# Altium project VEX Over Under.PrjPcb
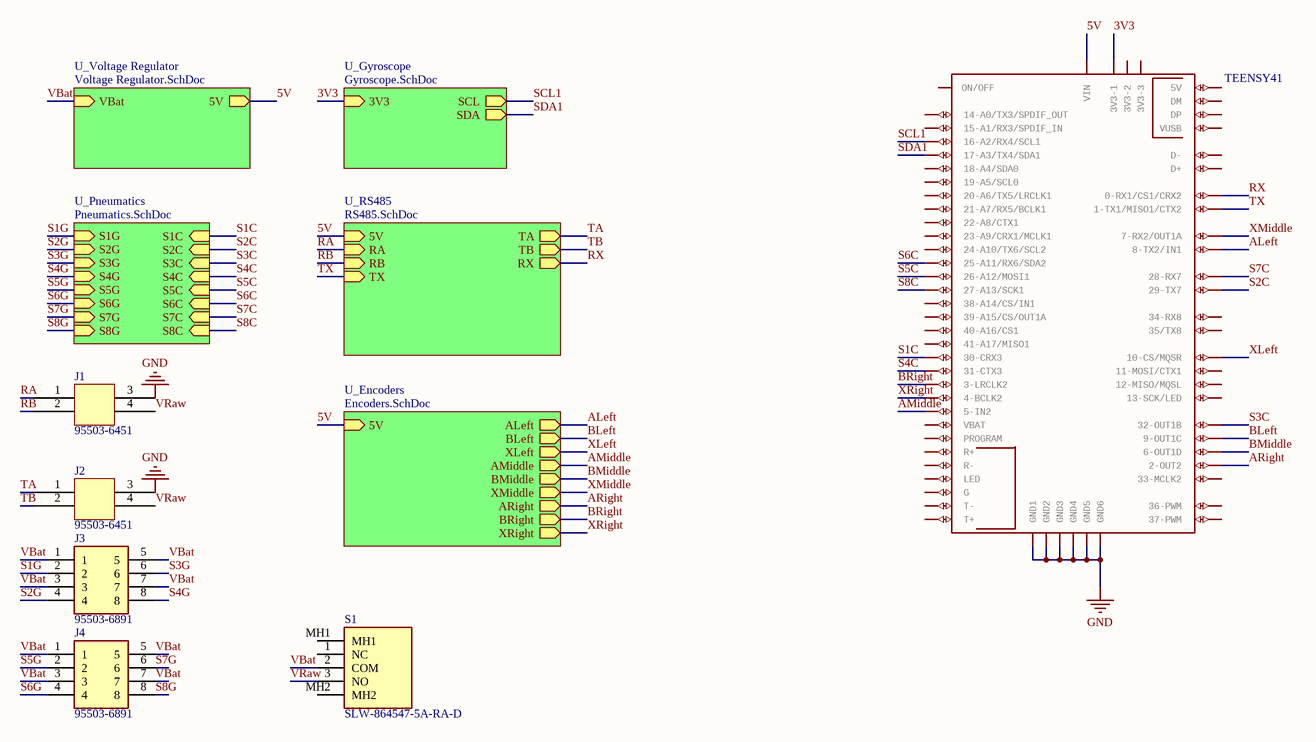
[diagram p0: Top Level.SchDoc]
6 sheets, 51 parts. Net scope: hierarchical (ports join the sheet entries above them; power ports are global).
Board file: JBrain.PcbDoc
Sheets:
  Top Level.SchDoc
    U_Voltage Regulator = Voltage Regulator.SchDoc
    U_Pneumatics = Pneumatics.SchDoc
    U_Gyroscope = Gyroscope.SchDoc
    U_RS485 = RS485.SchDoc
    U_Encoders = Encoders.SchDoc

## Sheet Top Level.SchDoc: Top Level
size A4; Engineer: Jason Zhou; Organization: JANK; DocumentNumber: 1; Revision: 1; SheetNumber: 1; SheetTotal: 6; Projectidentifier: V5 Co-processor

### Parts
J1  95503-6451  [95503-6451-Footprint-1]
J2  95503-6451  [95503-6451-Footprint-1]
J3  95503-6891  [95503-6891]
J4  95503-6891  [95503-6891]
S1  SLW-864547-5A-RA-D  [SLW8645475ARAD]
U1  TEENSY41  [TEENSY41]

### Sub-sheets
U_Encoders = Encoders.SchDoc: BLeft (out), ALeft (out), XLeft (out), BMiddle (out), AMiddle (out), XMiddle (out), BRight (out), ARight (out), XRight (out), 5V (in)
U_Gyroscope = Gyroscope.SchDoc: 3V3 (in), SCL (out), SDA (out)
U_Pneumatics = Pneumatics.SchDoc: S1G (in), S2G (in), S3G (in), S4G (in), S5G (in), S1C (in), S2C (in), S3C (in), S4C (in), S5C (in), S6G (in), S6C (in), S7C (in), S8G (in), S7G (in), S8C (in)
U_RS485 = RS485.SchDoc: TA (out), RA (in), 5V (in), RB (in), TB (out), RX (out), TX (in)
U_Voltage Regulator = Voltage Regulator.SchDoc: VBat (in), 5V (out)

### Nets
GND: J1.3 J2.3 U1.GND1 U1.GND2 U1.GND3 U1.GND4 U1.GND5 U1.GND6
3V3: U1.3V3-1 ; sheet U_Gyroscope/3V3
5V: U1.VIN ; sheet U_Voltage Regulator/5V, sheet U_RS485/5V, sheet U_Encoders/5V
ALeft: U1.8-TX2/IN1 ; sheet U_Encoders/ALeft
AMiddle: U1.5-IN2 ; sheet U_Encoders/AMiddle
ARight: U1.2-OUT2 ; sheet U_Encoders/ARight
BLeft: U1.9-OUT1C ; sheet U_Encoders/BLeft
BMiddle: U1.6-OUT1D ; sheet U_Encoders/BMiddle
BRight: U1.3-LRCLK2 ; sheet U_Encoders/BRight
RA: J1.1 ; sheet U_RS485/RA
RB: J1.2 ; sheet U_RS485/RB
RX: U1.0-RX1/CS1/CRX2 ; sheet U_RS485/RX
S1C: U1.30-CRX3 ; sheet U_Pneumatics/S1C
S1G: J3.2 ; sheet U_Pneumatics/S1G
S2C: U1.29-TX7 ; sheet U_Pneumatics/S2C
S2G: J3.4 ; sheet U_Pneumatics/S2G
S3C: U1.32-OUT1B ; sheet U_Pneumatics/S3C
S3G: J3.6 ; sheet U_Pneumatics/S3G
S4C: U1.31-CTX3 ; sheet U_Pneumatics/S4C
S4G: J3.8 ; sheet U_Pneumatics/S4G
S5C: U1.26-A12/MOSI1 ; sheet U_Pneumatics/S5C
S5G: J4.2 ; sheet U_Pneumatics/S5G
S6C: U1.25-A11/RX6/SDA2 ; sheet U_Pneumatics/S6C
S6G: J4.4 ; sheet U_Pneumatics/S6G
S7C: U1.28-RX7 ; sheet U_Pneumatics/S7C
S7G: J4.6 ; sheet U_Pneumatics/S7G
S8C: U1.27-A13/SCK1 ; sheet U_Pneumatics/S8C
S8G: J4.8 ; sheet U_Pneumatics/S8G
SCL1: U1.16-A2/RX4/SCL1 ; sheet U_Gyroscope/SCL  [project net SCL]
SDA1: U1.17-A3/TX4/SDA1 ; sheet U_Gyroscope/SDA  [project net SDA]
TA: J2.1 ; sheet U_RS485/TA
TB: J2.2 ; sheet U_RS485/TB
TX: U1.1-TX1/MISO1/CTX2 ; sheet U_RS485/TX
VBat: J3.1 J3.3 J3.5 J3.7 J4.1 J4.3 J4.5 J4.7 S1.2(COM) ; sheet U_Voltage Regulator/VBat
VRaw: J1.4 J2.4 S1.3(NO)
XLeft: U1.10-CS\MQSR(10-CS/MQSR) ; sheet U_Encoders/XLeft
XMiddle: U1.7-RX2/OUT1A ; sheet U_Encoders/XMiddle
XRight: U1.4-BCLK2 ; sheet U_Encoders/XRight

Not connected (* = marked no-connect by the designer): S1 1(NC) MH1 MH2; U1 3V3-2 3V3-3 11-MOSI/CTX1 12-MISO/MQSL 13-SCK/LED 14-A0/TX3/SPDIF_OUT 15-A1/RX3/SPDIF_IN 18-A4/SDA0 19-A5/SCL0 20-A6/TX5/LRCLK1 21-A7/RX5/BCLK1 22-A8/CTX1 23-A9/CRX1/MCLK1 24-A10/TX6/SCL2 33-MCLK2 34-RX8 35-TX8(35/TX8) 36-PWM 37-PWM 38-A14/CS/IN1 39-A15/CS/OUT1A 40-A16/CS1 41-A17/MISO1 +5V(5V) D+ D- DM DP G LED ON/OFF PROGRAM R+ R- T+ T- VBAT VUSB

### Notes on the sheet
- Size:
- Date:
- Title
- A4
- Project:
- Time:
- Revision:
- Sheet
- of
- Engineer
- File:

### Library data of the parts
J1 J2 = CMP-002-00072-2: Telecom and Datacom Connector, 4 Contact(s), Female, Straight, Surface Mount Terminal, Locking, Jack, 4p4c; RoHS Compliant: Yes; Mounting Technology: Board; Connector Type: TELECOM AND DATACOM CONNECTOR; Min Operating Temperature: -40°C; Max Operating Temperature: 85°C
J3 J4 = 95503-6891: Connector; Manufacturer_Name: Molex; Datasheet Link: https://datasheet.datasheetarchive.com/originals/distributors/Datasheets-DGA5/408567.pdf; Manufacturer_Part_Number: 95503-6891; Mouser Part Number: 538-95503-6891; Mouser Price/Stock: https://www.mouser.co.uk/ProductDetail/Molex/95503-6891?qs=MJut%252BdqOEgjIr%252BakMzdZ%252BA%3D%3D
S1 = SLW-864547-5A-RA-D: Switch; Manufacturer_Name: CUI Devices; Datasheet Link: https://www.cuidevices.com/product/resource/slw-864547-5a-ra-d.pdf; Height: 4.9mm; Manufacturer_Part_Number: SLW-864547-5A-RA-D; Mouser Part Number: 179-SLW-864547-5ARAD; Mouser Price/Stock: https://www.mouser.co.uk/ProductDetail/CUI-Devices/SLW-864547-5A-RA-D?qs=1Kr7Jg1SGW%252Bn%2FarYZIP3WQ%3D%3D; Arrow Part Number: SLW-864547-5A-RA-D; Arrow Price/Stock: https://www.arrow.com/en/products/slw-864547-5a-ra-d/cui-devices?region=nac
U1 = CMP-007-000001-4: Teensy 4.1 Development Board; Core Architecture: ARM; Evaluation Kit: Yes; GateName_1: G$1; LibraryName: teensy; Package: TEENSY41; DeviceSetName: TEENSY41; Source: teensy.SCHLIB; Series: i.MX; SymbolName_1: TEENSY41; Design Item ID: TEENSY41

## Sheet Voltage Regulator.SchDoc: Voltage Regulator
size A4; Author: Jason Zhou; Engineer: Jason Zhou; Revision: 1; SheetNumber: 2; SheetTotal: 5; Projectidentifier: V5 Coprocessor; SPICEModelCacheAZWFLMOM: <root> / <DocumentId>AZWFLMOM</DocumentId> / </root>
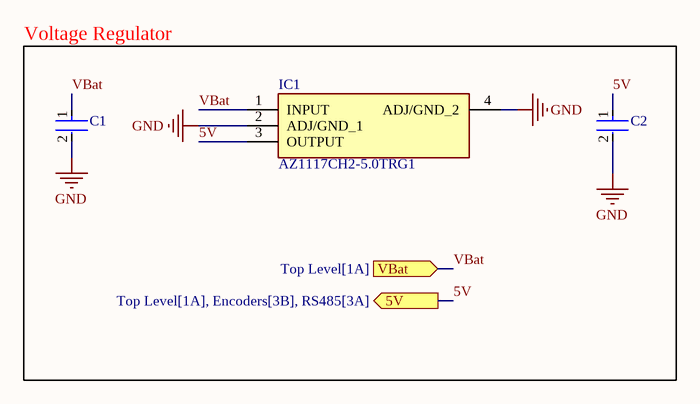
[diagram p1: Voltage Regulator.SchDoc]

### Parts
C1  CL31A106MAHNNNE  [FP-CL31-IPC_B]  (value not drawn)
C2  CL31A226MOCLNNC  [FP-CL31-IPC_A]  (value not drawn)
IC1  AZ1117CH2-5.0TRG1  [SOT230P700X180-4N]

### Blocks framed on the sheet
Voltage Regulator: C1 C2 IC1

### Ports
5V (out, see Top Level[1A], Encoders[3B], RS485[3A]), VBat (in, see Top Level[1A])

### Nets
GND: C1.2 C2.2 IC1.2(ADJ/GND_1) IC1.4(ADJ/GND_2)
5V: C2.1 IC1.3(OUTPUT) ; port 5V
VBat: C1.1 IC1.1(INPUT) ; port VBat

### Notes on the sheet
- Size:
- Date:
- Title
- A4
- Project:
- Time:
- Revision:
- Sheet
- of
- Engineer
- File:

### Library data of the parts
C1 = CMP-13271-000714-1: Cap Ceramic 10uF 25V X5R ±20% SMD 1206 +85°C Embossed T/R; Depth: 1.6mm; Length: 3.2mm; Thickness: 0.071inch; Voltage Rating: 25V; Width: 0.063inch; Mount: Surface Mount; Height: 1.6mm; Dielectric: X5R; Case Code (Metric): 3216; Case/Package: 1206; Radiation Hardening: No; Lead Free: Lead Free; Min Operating Temperature: -55°C; Tolerance: 20%; Voltage Rating (DC): 25V; Packaging: Tape and Reel; Capacitance: 10uF; Case Code (Imperial): 1206; Max Operating Temperature: 85°C
C2 = CMP-13271-002013-1: Cap Ceramic 22uF 16V X5R ±20% SMD 1206 +85°C Embossed T/R; Height: 0.85mm; Min Operating Temperature: -55°C; Thickness: 0.037inch; Depth: 1.6mm; Length: 3.2mm; Tolerance: 20%; Case Code (Imperial): 1206; Capacitance: 22uF; Package Quantity: 1; Radiation Hardening: No; Case/Package: 1206; Dielectric: X5R; Packaging: Tape and Reel; Voltage: 16V; Case Code (Metric): 3216; Width: 0.063inch; Lead Free: Lead Free; Mount: Surface Mount; Voltage Rating: 16V; Max Operating Temperature: 85°C
IC1 = AZ1117CH2-5.0TRG1: Integrated Circuit; Manufacturer_Name: Diodes Incorporated; Datasheet Link: https://www.arrow.com/en/products/az1117ch2-5.0trg1/diodes-incorporated; Height: 1.8mm; Manufacturer_Part_Number: AZ1117CH2-5.0TRG1; Mouser Part Number: 621-AZ1117CH2-5.0TRG; Mouser Price/Stock: https://www.mouser.co.uk/ProductDetail/Diodes-Incorporated/AZ1117CH2-5.0TRG1?qs=5V6w%252Be2aIqb578qtLdqPjw%3D%3D; Arrow Part Number: AZ1117CH2-5.0TRG1; Arrow Price/Stock: https://www.arrow.com/en/products/az1117ch2-5.0trg1/diodes-incorporated

## Sheet Pneumatics.SchDoc: Solenoid Drivers
size A4; Engineer: Jason Zhou; SheetNumber: 3; SheetTotal: 5; projectidentifier: V5 Co-processor
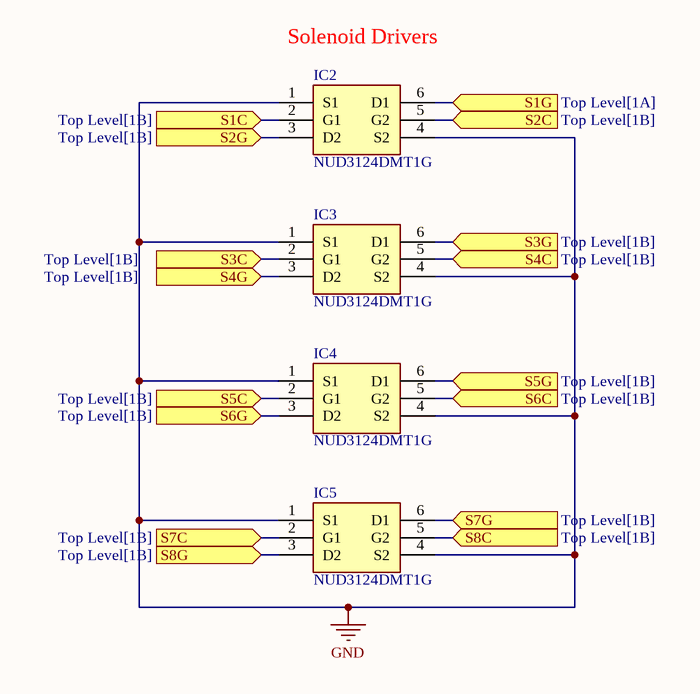
[diagram p2: Pneumatics.SchDoc]

### Parts
IC2  NUD3124DMT1G  [SOT95P275X110-6N]
IC3  NUD3124DMT1G  [SOT95P275X110-6N]
IC4  NUD3124DMT1G  [SOT95P275X110-6N]
IC5  NUD3124DMT1G  [SOT95P275X110-6N]

### Ports
S1C (in, see Top Level[1B]), S1G (in, see Top Level[1A]), S2C (in, see Top Level[1B]), S2G (in, see Top Level[1B]), S3C (in, see Top Level[1B]), S3G (in, see Top Level[1B]), S4C (in, see Top Level[1B]), S4G (in, see Top Level[1B]), S5C (in, see Top Level[1B]), S5G (in, see Top Level[1B]), S6C (in, see Top Level[1B]), S6G (in, see Top Level[1B]), S7C (in, see Top Level[1B]), S7G (in, see Top Level[1B]), S8C (in, see Top Level[1B]), S8G (in, see Top Level[1B])

### Nets
GND: IC2.1(S1) IC2.4(S2) IC3.1(S1) IC3.4(S2) IC4.1(S1) IC4.4(S2) IC5.1(S1) IC5.4(S2)
S1C: IC2.2(G1) ; port S1C
S1G: IC2.6(D1) ; port S1G
S2C: IC2.5(G2) ; port S2C
S2G: IC2.3(D2) ; port S2G
S3C: IC3.2(G1) ; port S3C
S3G: IC3.6(D1) ; port S3G
S4C: IC3.5(G2) ; port S4C
S4G: IC3.3(D2) ; port S4G
S5C: IC4.2(G1) ; port S5C
S5G: IC4.6(D1) ; port S5G
S6C: IC4.5(G2) ; port S6C
S6G: IC4.3(D2) ; port S6G
S7C: IC5.2(G1) ; port S7C
S7G: IC5.6(D1) ; port S7G
S8C: IC5.5(G2) ; port S8C
S8G: IC5.3(D2) ; port S8G

### Notes on the sheet
- (near IC2) Solenoid Drivers
- Size:
- Date:
- Title
- A4
- Project:
- Time:
- Revision:
- Sheet
- of
- Engineer
- File:

### Library data of the parts
IC2-IC5 = NUD3124DMT1G: Integrated Circuit; Manufacturer_Name: onsemi; Datasheet Link: http://www.onsemi.com/pub/Collateral/NUD3124-D.PDF; Height: 1.1mm; Manufacturer_Part_Number: NUD3124DMT1G; Mouser Part Number: 863-NUD3124DMT1G; Mouser Price/Stock: https://www.mouser.co.uk/ProductDetail/onsemi/NUD3124DMT1G?qs=ZXBb0xZ9WeDtXMbpPTBW4g%3D%3D; Arrow Part Number: NUD3124DMT1G; Arrow Price/Stock: https://www.arrow.com/en/products/nud3124dmt1g/on-semiconductor?region=nac

## Sheet Gyroscope.SchDoc: Gyroscope
size A4; Author: Jason Zhou; Engineer: Jason Zhou; SheetNumber: 4; SheetTotal: 6; Projectidentifier: V5 Co-processor
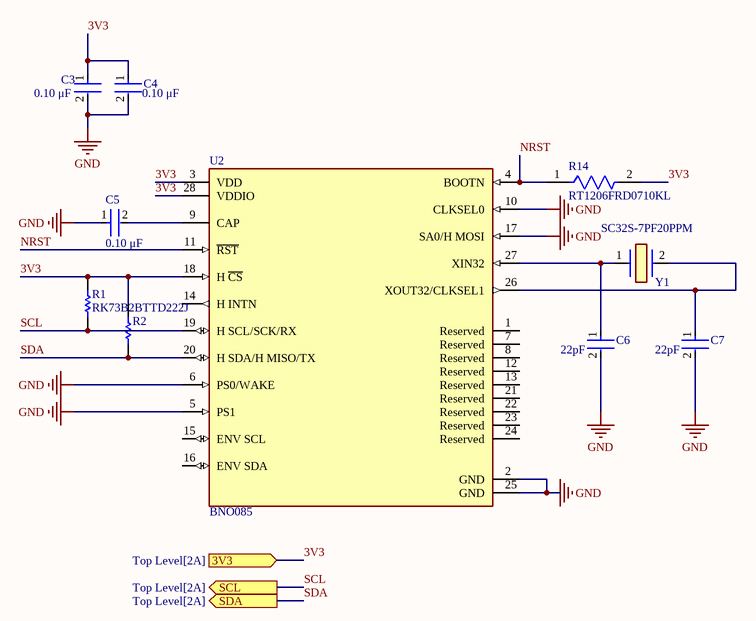
[diagram p3: Gyroscope.SchDoc]

### Parts
C3  Capacitance: 0.10 μF  [FP-C1206C-EB-MFG]  (hidden comment: C1206C104M5RACTU)
C4  Capacitance: 0.10 μF  [FP-C1206C-EB-MFG]  (hidden comment: C1206C104M5RACTU)
C5  Capacitance: 0.10 μF  [FP-C1206C-EB-MFG]  (hidden comment: C1206C104M5RACTU)
C6  Capacitance: 22pF  [FP-CL31-IPC_A]  (hidden comment: CL31C220JBCNNNC)
C7  Capacitance: 22pF  [FP-CL31-IPC_A]  (hidden comment: CL31C220JBCNNNC)
R1  RK73B2BTTD222J  [RESC3216X70X40LL20T20]
R2  RK73B2BTTD222J  [RESC3216X70X40LL20T20]  (value not drawn)
R14  RT1206FRD0710KL  [FP-RT1206-MFG]
U2  BNO085  [FP-BNO085-MFG]
Y1  SC32S-7PF20PPM  [SC32S7PF20PPM]

### Ports
3V3 (in, see Top Level[2A]), SCL (out, see Top Level[2A]), SDA (out, see Top Level[2A])

### Nets
GND: C3.2 C4.2 C5.1 C6.2 C7.2 U2.2(GND) U2.5(PS1) U2.6(PS0/WAKE) U2.10(CLKSEL0) U2.17(SA0/H_MOSI) U2.25(GND)
3V3: C3.1 C4.1 R1.2 R2.2 R14.2 U2.3(VDD) U2.18(H_~{CS}) U2.28(VDDIO) ; port 3V3
NRST: R14.1 U2.4(BOOTN) U2.11(~{RST})
SCL: R1.1 U2.19(H_SCL/SCK/RX) ; port SCL
SDA: R2.1 U2.20(H_SDA/H_MISO/TX) ; port SDA
NetC5_2: C5.2 U2.9(CAP)
NetC6_1: C6.1 U2.27(XIN32) Y1.1
NetC7_1: C7.1 U2.26(XOUT32/CLKSEL1) Y1.2

Not connected (* = marked no-connect by the designer): U2 1(Reserved) 7(Reserved) 8(Reserved) 12(Reserved) 13(Reserved) 14(H_INTN) 15(ENV_SCL) 16(ENV_SDA) 21(Reserved) 22(Reserved) 23(Reserved) 24(Reserved)

### Notes on the sheet
- Size:
- Date:
- Title
- A4
- Project:
- Time:
- Revision:
- Sheet
- of
- Engineer
- File:

### Library data of the parts
C3-C5 = CMP-03020-028488-1: CAP CER 0.1UF 50V X7R 1206; Manufacturer: KEMET; Material: Ceramic; Automotive Grade: Grade 0; Value: 0.10 μF; Tolerance: 0.2; Temperature Coefficient: 15%; Device Class L3: Ceramic Capacitors; Device Class L1: Passive Components; Category: Cap; Octopart: https://octopart.com/c1206c104m5ractu-kemet-129344; Temperature Range Low: -55°C; RoHS: TRUE; Manufacturer Part Number: C1206C104M5RACTU; Lead Free: Yes; Package: C1206C-EB; Digikey Description: CAP CER 0.1UF 50V X7R 1206; Automotive: Yes; Height: 0.88mm; Device Class L2: Capacitors; ComponentLink2Description: Datasheet; Mouser Description: Multilayer Ceramic Capacitors MLCC - SMD/SMT 50volts 0.1uF X7R 20%; Temperature: -55°C to +150°C; Temperature Characteristic: X7R; ComponentLink2URL: https://content.kemet.com/datasheets/KEM_C1007_X8R_ULTRA_150C_SMD.pdf; Ipc Land Pattern Name: CAPC320160X78; Temperature Range High: +150°C; Voltage Rating: 50 V
C6 C7 = CMP-13271-001055-1: Cap Ceramic 22pF 50V C0G ±5% SMD 1206 +125°C Embossed T/R; Temperature Coefficient: 300ppm/°C; Packaging: Tape and Reel; Material: Ceramic; Package Quantity: 1; Thickness: 0.039inch; Voltage: 50V; Height: 0.85mm; Radiation Hardening: No; Mount: Surface Mount; Width: 0.063inch; Min Operating Temperature: -55°C; Max Operating Temperature: 125°C; Voltage Rating (DC): 50V; Voltage Rating: 50V; Case/Package: 1206; Case Code (Metric): 3216; Tolerance: 5%; Length: 3.2mm; Dielectric: C0G; Lead Free: Lead Free; Depth: 1.6mm; Case Code (Imperial): 1206
R1 R2 = CMP-2003-04576-1: Manufacturer: KOA Speer; Part Number: RK73B2BTTD222J
R14 = CMP-03412-004711-1: RES SMD 10K OHM 1% 1/4W 1206; Manufacturer: Yageo; Description: RT1206 10KΩ 0.25W 25 ppm/°C 0.02%; Voltage Rating: 200V; Power Rating: 0.25W; Tolerance: 0.0002; Value: 10KΩ; Temperature Coefficient: 25 ppm/°C; Series: RT; Composition: Thin Film; Device Class L3: Chip SMD Resistors; Temperature: -55°C to +155°C; Device Class L1: Passive Components; ComponentLink2Description: Datasheet; Lead Free: Yes; ComponentLink2URL: http://www.yageo.com/documents/recent/PYu-RT_1-to-0.01_RoHS_L_9.pdf; Footprint Url: http://www.yageo.com/exep/pages/download/literatures/PYu-R_Mount_10.pdf; Height: 0.65mm; Ipc Land Pattern Name: RESC310160X55; Device Class L2: Resistors; Category: Res; Package: RT1206; Manufacturer Part Number: RT1206FRD0710KL; RoHS: TRUE; Digikey Description: RES SMD 10K OHM 1% 1/4W 1206; Automotive: No; Temperature Range High: +155°C; Resistance: 10KΩ; Octopart: https://octopart.com/rt1206frd0710kl-yageo-71404185; Temperature Range Low: -55°C
U2 = CMP-031-00006-4: IMU ACCEL/GYRO/MAG I2C 32BIT
Y1 = SC32S-7PF20PPM: Crystal or Oscillator; Manufacturer_Name: Seiko Semiconductors; Datasheet Link: https://www.mouser.com/datasheet/2/360/file_PRODUCT_MASTER_50812_GRAPHIC03-542305.pdf; Manufacturer_Part_Number: SC32S-7PF20PPM; Mouser Part Number: 628-SC32S-7PF20PPM; Mouser Price/Stock: https://www.mouser.co.uk/ProductDetail/Seiko-Semiconductors/SC32S-7PF20PPM?qs=3CPZD7qAgigZSR1ASVAS6w%3D%3D

## Sheet RS485.SchDoc: RS485 Transceiver
size A4; Author: Jason Zhou; Engineer: Jason Zhou; SheetNumber: 5; SheetTotal: 6; projectidentifier: V5 Co-proccessor; SPICEModelCacheHKPDKEBW: <root> / <DocumentId>HKPDKEBW</DocumentId> / </root>
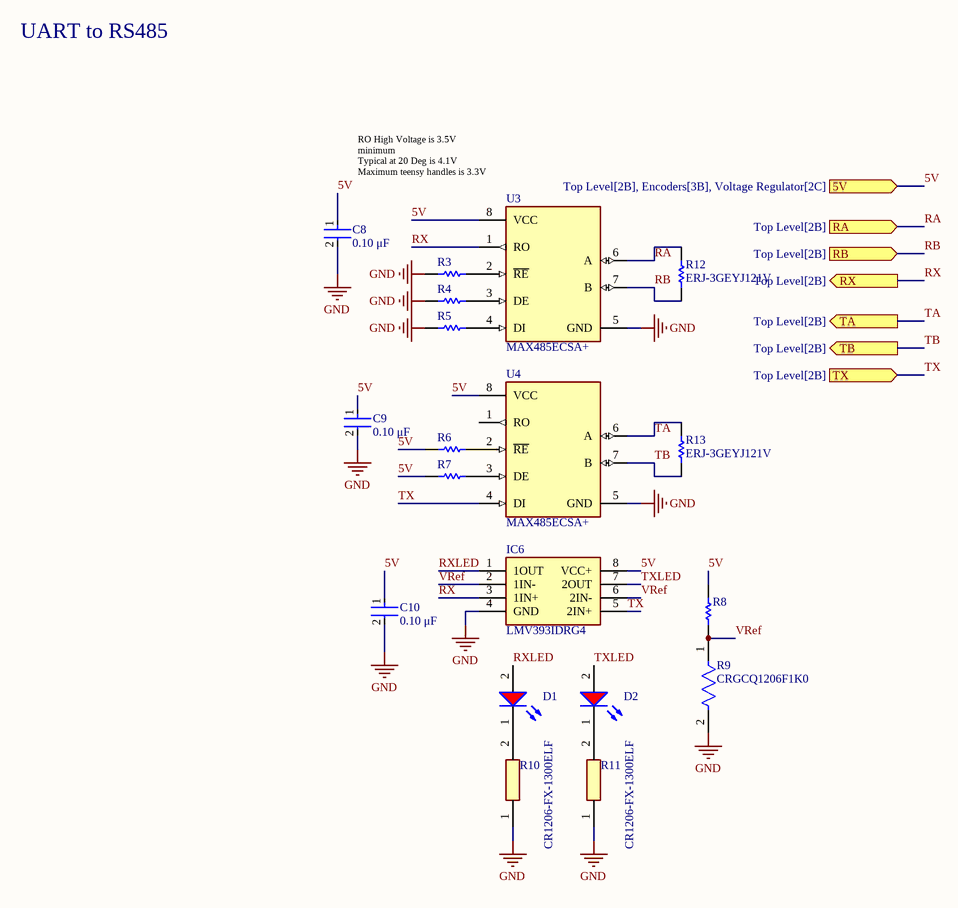
[diagram p4: RS485.SchDoc]

### Parts
C8  Capacitance: 0.10 μF  [FP-C1206C-EB-MFG]  (hidden comment: C1206C104M5RACTU)
C9  Capacitance: 0.10 μF  [FP-C1206C-EB-MFG]  (hidden comment: C1206C104M5RACTU)
C10  Capacitance: 0.10 μF  [FP-C1206C-EB-MFG]  (hidden comment: C1206C104M5RACTU)
D1  150120RS75000  [WL-SMCW_1206_150120xx75000]  (value not drawn)
D2  150120RS75000  [WL-SMCW_1206_150120xx75000]  (value not drawn)
IC6  LMV393IDRG4  [SOIC127P600X175-8N]
R3  RK73H2BTTD4701F  [RESC3216X70X40NL20T20]  (value not drawn)
R4  RK73H2BTTD4701F  [RESC3216X70X40NL20T20]  (value not drawn)
R5  RK73H2BTTD4701F  [RESC3216X70X40NL20T20]  (value not drawn)
R6  RK73H2BTTD4701F  [RESC3216X70X40NL20T20]  (value not drawn)
R7  RK73H2BTTD4701F  [RESC3216X70X40NL20T20]  (value not drawn)
R8  RK73B2BTTD222J  [RESC3216X70X40LL20T20]  (value not drawn)
R9  CRGCQ1206F1K0  [FP-CRGCQ1206-IPC_C]
R10  CR1206-FX-1300ELF  [RESC3216X75N]
R11  CR1206-FX-1300ELF  [RESC3216X75N]
R12  ERJ-3GEYJ121V  [RESC1608X55X30LL15T15]
R13  ERJ-3GEYJ121V  [RESC1608X55X30LL15T15]
U3  MAX485ECSA+  [FP-S8-5-MFG]
U4  MAX485ECSA+  [FP-S8-5-MFG]

### Ports
5V (in, see Top Level[2B], Encoders[3B], Voltage Regulator[2C]), RA (in, see Top Level[2B]), RB (in, see Top Level[2B]), RX (out, see Top Level[2B]), TA (out, see Top Level[2B]), TB (out, see Top Level[2B]), TX (in, see Top Level[2B])

### Nets
GND: C8.2 C9.2 C10.2 IC6.4(GND) R3.2 R4.2 R5.2 R9.2 R10.1 R11.1 U3.5(GND) U4.5(GND)
5V: C8.1 C9.1 C10.1 IC6.8(VCC+) R6.2 R7.2 R8.2 U3.8(VCC) U4.8(VCC) ; port 5V
RA: R12.2 U3.6(A) ; port RA
RB: R12.1 U3.7(B) ; port RB
RX: IC6.3(1IN+) U3.1(RO) ; port RX
RXLED: D1.2(A) IC6.1(1OUT)
TA: R13.2 U4.6(A) ; port TA
TB: R13.1 U4.7(B) ; port TB
TX: IC6.5(2IN+) U4.4(DI) ; port TX
TXLED: D2.2(A) IC6.7(2OUT)
VRef: IC6.2(1IN-) IC6.6(2IN-) R8.1 R9.1
NetD1_1: D1.1(K) R10.2
NetD2_1: D2.1(K) R11.2
NetR3_1: R3.1 U3.2(~{RE})
NetR4_1: R4.1 U3.3(DE)
NetR5_1: R5.1 U3.4(DI)
NetR6_1: R6.1 U4.2(~{RE})
NetR7_1: R7.1 U4.3(DE)

Not connected (* = marked no-connect by the designer): U4 1(RO)

### Notes on the sheet
- UART to RS485
- RO High Voltage is 3.5V minimum
  Typical at 20 Deg is 4.1V
  Maximum teensy handles is 3.3V
- Size:
- Date:
- Title
- A4
- Project:
- Time:
- Revision:
- Sheet
- of
- Engineer
- File:

### Library data of the parts
C8-C10 = CMP-03020-028488-1: as C3 on sheet Gyroscope; Device Class L3: Ceramic Capacitors; Device Class L1: Passive Components; Category: Cap; Octopart: https://octopart.com/c1206c104m5ractu-kemet-129344; Temperature Range Low: -55°C; RoHS: TRUE; Manufacturer Part Number: C1206C104M5RACTU; Lead Free: Yes; Package: C1206C-EB; Digikey Description: CAP CER 0.1UF 50V X7R 1206; Automotive: Yes; Height: 0.88mm; Device Class L2: Capacitors; ComponentLink2Description: Datasheet; Mouser Description: Multilayer Ceramic Capacitors MLCC - SMD/SMT 50volts 0.1uF X7R 20%; Temperature: -55°C to +150°C; Temperature Characteristic: X7R; ComponentLink2URL: https://content.kemet.com/datasheets/KEM_C1007_X8R_ULTRA_150C_SMD.pdf; Ipc Land Pattern Name: CAPC320160X78; Temperature Range High: +150°C; Voltage Rating: 50 V
D1 D2 = CMP-1426-00013-3: NexarPartId: 29717788; Dominant Wavelength: 625nm; Max Reverse Voltage (DC): 5V; Luminous Intensity: 150mcd; Color: Red; Peak Wavelength: 630nm; Test Current: 20mA; Max Junction Temperature (Tj): 95°C; Power Dissipation: 72mW; Viewing Angle: 140°; Forward Voltage: 2V; Lens Style: Clear, Rectangular; Forward Current: 100mA; Mount: Surface Mount; Wavelength: 625nm; REACH SVHC: Unknown; Case Code (Imperial): 1206; Case Code (Metric): 3216; RoHS: Compliant; Width: 1.6mm; Min Operating Temperature: -40°C; Reverse Voltage: 5V; Max Operating Temperature: 85°C; Case/Package: 1206; Height: 680µm; Length: 3.2mm; Packaging: Tape and Reel
IC6 = LMV393IDRG4: Integrated Circuit; Manufacturer_Name: Texas Instruments; Datasheet Link: https://www.ti.com/lit/gpn/lmv393; Height: 1.75mm; Manufacturer_Part_Number: LMV393IDRG4; Mouser Part Number: 595-LMV393IDRG4; Mouser Price/Stock: https://www.mouser.co.uk/ProductDetail/Texas-Instruments/LMV393IDRG4?qs=tP77tliwutC5frth4oKpcg%3D%3D; Arrow Part Number: LMV393IDRG4; Arrow Price/Stock: https://www.arrow.com/en/products/lmv393idrg4/texas-instruments?region=nac
R3-R7 = CMP-2003-01471-1: Manufacturer: KOA Speer; Part Number: RK73H2BTTD4701F
R8 = CMP-2003-04576-1: Manufacturer: KOA Speer; Value: 2.2k; Part Number: RK73B2BTTD222J
R9 = CMP-03211-006592-1: CRGCQ1206 1KΩ 0.25W 1% ±100ppm/°C 200V; Manufacturer: TE Connectivity; Automotive Grade: Grade 685; Tolerance: 0.01; Ipc Land Pattern Name: RESC310155X55; Temperature Range Low: -55°C; Device Class L3: Chip SMD Resistors; ComponentLink2URL: https://www.te.com/commerce/DocumentDelivery/DDEController?Action=showdoc&DocId=Data+Sheet%7F1773204-3%7F1%7Fpdf%7FEnglish%7FENG_DS_1773204-3_1.pdf%7F4-2176347-694; Automotive: Yes; Temperature: -55°C to +155°C; Manufacturer Part Number: CRGCQ1206F1K0; Package: CRGCQ1206; Octopart: https://octopart.com/crgcq1206f1k0-te+connectivity-91018258; Device Class L1: Passive Components; Series: CRGCQ; Device Class L2: Resistors; RoHS: TRUE; Lead Free: Yes; ComponentLink2Description: Datasheet; Power Rating: 0.25W; Temperature Coefficient: ±100ppm/°C; Value: 1KΩ; Voltage Rating: 200V; Temperature Range High: +155°C; Height: 0.65mm; Category: Res; Resistance: 1KΩ; Composition: Thick Film; Ambient Temperature Range High: +70°C
R10 R11 = CR1206-FX-1300ELF: Resistor; Manufacturer_Name: Bourns; Datasheet Link: http://www.bourns.com/data/global/pdfs/CHPREZTR.pdf; Height: 0.75mm; Manufacturer_Part_Number: CR1206-FX-1300ELF; Mouser Part Number: 652-CR1206FX-1300ELF; Mouser Price/Stock: http://www.mouser.com/Search/ProductDetail.aspx?qs=3wWX5hyYeeSCpYLK5R9snA%3d%3d
R12 R13 = CMP-2000-00713-1: Manufacturer: Panasonic; Part Number: ERJ-3GEYJ121V
U3 U4 = CMP-05679-000003-1: IC TXRX RS485/RS422 8-SOIC; Manufacturer: Maxim Integrated; Number Of Receivers: 1; Simplex Duplex: Half Duplex; Data Rate: 2.5Mbits/s; Nominal Supply Current: 300-500uA; Standoff Height: 0.1mm; Min Supply Voltage: 4.75V; Max Supply Voltage: 5.25V; Interface: RS-485,RS-422; Device Class L3: RS-232 / RS-422 / RS-485 Interface ICs; Temperature Range Low: 0°C; Automotive: No; Temperature: 0°C to +70°C; Digikey Description: IC TXRX RS485/RS422 8-SOIC; ComponentLink2URL: https://datasheets.maximintegrated.com/en/ds/MAX1487E-MAX491E.pdf; Lead Free: Yes; Manufacturer Part Number: MAX485ECSA+; Device Class L1: Integrated Circuits (ICs); Device Class L2: Interface ICs; RoHS: TRUE; ComponentLink2Description: Datasheet; Category: IC; Package: S8-5; Octopart: https://octopart.com/max485ecsa%2B-maxim+integrated-39397871; Footprint Url: https://pdfserv.maximintegrated.com/land_patterns/90-0096.PDF; Mouser Description: MAX485E Series 2.5 Mbps 12 V Half-Duplex SMT RS 485 Transceiver - SOIC-8; Temperature Range High: +70°C; Number Of Transmitters: 1; Height: 1.75mm

## Sheet Encoders.SchDoc: Encoders
size A4; Engineer: Jason Zhou; DocumentNumber: 1; Revision: 0; SheetNumber: 6; SheetTotal: 6; Projectidentifier: V5 Co-proccessor
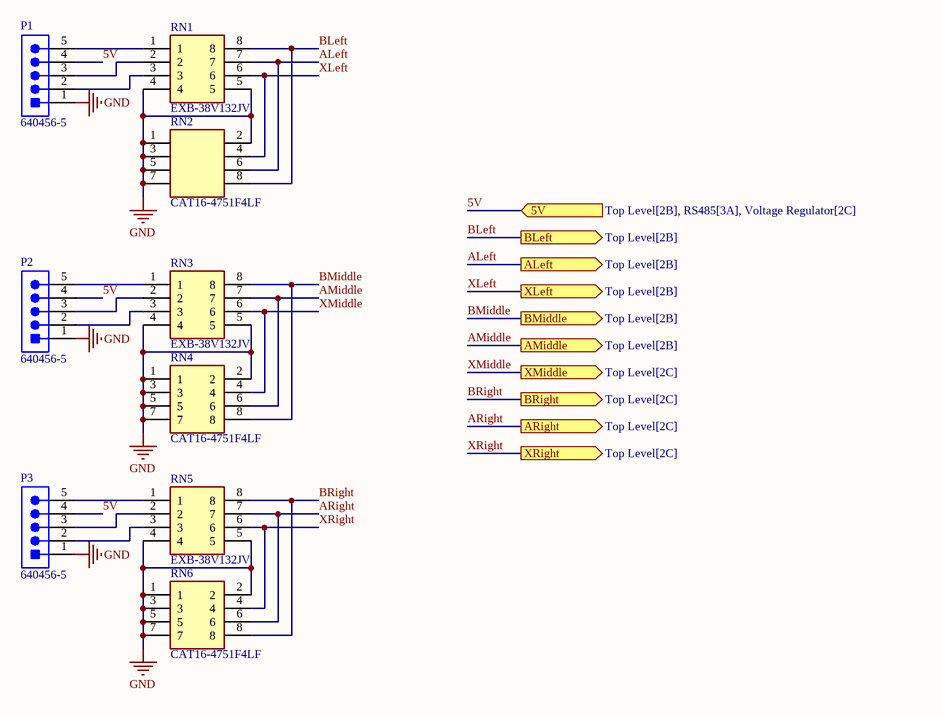
[diagram p5: Encoders.SchDoc]

### Parts
P1  640456-5  [TECO-640456-5]
P2  640456-5  [TECO-640456-5]
P3  640456-5  [TECO-640456-5]
RN1  EXB-38V132JV  [EXB38V132JV]
RN2  CAT16-4751F4LF  [CAPCAV80P155X320X60-8L]
RN3  EXB-38V132JV  [EXB38V132JV]
RN4  CAT16-4751F4LF  [CAPCAV80P155X320X60-8L]
RN5  EXB-38V132JV  [EXB38V132JV]
RN6  CAT16-4751F4LF  [CAPCAV80P155X320X60-8L]

### Ports
5V (in, see Top Level[2B], RS485[3A], Voltage Regulator[2C]), ALeft (out, see Top Level[2B]), AMiddle (out, see Top Level[2B]), ARight (out, see Top Level[2C]), BLeft (out, see Top Level[2B]), BMiddle (out, see Top Level[2B]), BRight (out, see Top Level[2C]), XLeft (out, see Top Level[2B]), XMiddle (out, see Top Level[2C]), XRight (out, see Top Level[2C])

### Nets
GND: P1.1(DTR) P2.1(DTR) P3.1(DTR) RN1.4 RN1.5 RN2.1 RN2.2 RN2.3 RN2.5 RN2.7 RN3.4 RN3.5 RN4.1 RN4.2 RN4.3 RN4.5 RN4.7 RN5.4 RN5.5 RN6.1 RN6.2 RN6.3 RN6.5 RN6.7
5V: P1.4(VCC) P2.4(VCC) P3.4(VCC) ; port 5V
ALeft: RN1.7 RN2.6 ; port ALeft
AMiddle: RN3.7 RN4.6 ; port AMiddle
ARight: RN5.7 RN6.6 ; port ARight
BLeft: RN1.8 RN2.8 ; port BLeft
BMiddle: RN3.8 RN4.8 ; port BMiddle
BRight: RN5.8 RN6.8 ; port BRight
XLeft: RN1.6 RN2.4 ; port XLeft
XMiddle: RN3.6 RN4.4 ; port XMiddle
XRight: RN5.6 RN6.4 ; port XRight
NetP1_2: P1.2(RXI) RN1.3
NetP1_3: P1.3(TXO) RN1.2
NetP1_5: P1.5(CTS) RN1.1
NetP2_2: P2.2(RXI) RN3.3
NetP2_3: P2.3(TXO) RN3.2
NetP2_5: P2.5(CTS) RN3.1
NetP3_2: P3.2(RXI) RN5.3
NetP3_3: P3.3(TXO) RN5.2
NetP3_5: P3.5(CTS) RN5.1

### Notes on the sheet
- Size:
- Date:
- Title
- A4
- Project:
- Time:
- Revision:
- Sheet
- of
- Engineer
- File:

### Library data of the parts
P1-P3 = CMP-1684-00014-1: Male Header, Pitch 2.54 mm, 1 x 5 Position, Height 10.03 mm, Tail Length 3.56 mm, / -55 to 105 degC, RoHS, Bulk; Manufacturer: TE Connectivity; Material, Housing: Polyester; Brand/Series: MTA-100Series; Color, Housing: White; Current, Rating: 5 / A; Temperature, Operating: -55to+105 / °C; Connector Type: MTA-100; Agency Approvals: CSA,UL; Material, Contact: CopperAlloy; Mounting Hole Size: 0.04 / "; Voltage, Rating: 250 / V; Contact Termination Area Plating: Tin; Pin Spacing: 0.1 / "; Primary Type: InterconnectSystem; Special Features: Pinstrip; Mount Angle: Vertical; Contact Centerline Spacing: 0.100 / in.; Number of Contacts: 5; Standards: RoHSCompliant,ELVCompliant,UL94V-0; Angle: Straight; Length, Terminal Post: 0.14 / in.; Manufacturer URL: http://www.te.com; Flammability Rating: UL94V-0; Mounting Type: PCMount; Termination: Solder; Package Reference: THD; Length, Overall: 0.5 / "; Contact Mating Area Plating: Tin; Length, Pin: 0.14 / "; Datasheet URL: http://sigma.octopart.com/77881742/technical_drawing/TE-Connectivity-640456-5.pdf; Package Description: Male Header, Pitch 2.54 mm, 1 x 5 Position, Height 10.03 mm, Tail Length 3.56 mm; Datasheet Version: Rev. W3; Contact Plating: Tin; Color: White; Number of Positions: 5; Type: PCBPlug; Contact Shape: Square; Number of Rows: 1; Size, Post: 0.025 / in.
RN1 RN3 RN5 = EXB-38V132JV: Resistor Network; Manufacturer_Name: Panasonic; Datasheet Link: https://industrial.panasonic.com/cdbs/www-data/pdf/AOC0000/AOC0000C14.pdf; Height: 0.6mm; Manufacturer_Part_Number: EXB-38V132JV; Mouser Part Number: 667-EXB-38V132JV; Mouser Price/Stock: https://www.mouser.co.uk/ProductDetail/Panasonic/EXB-38V132JV?qs=WwqriLBepZuuySSdwYXZFg%3D%3D
RN2 RN4 RN6 = CAT16-4751F4LF: Resistor Network; Manufacturer_Name: Bourns; Datasheet Link: http://www.bourns.com/docs/Product-Datasheets/cat16-j.pdf; Height: 0.6mm; Manufacturer_Part_Number: CAT16-4751F4LF; Mouser Part Number: 652-CAT16-4751F4LF; Mouser Price/Stock: https://www.mouser.co.uk/ProductDetail/Bourns/CAT16-4751F4LF?qs=vP03yYafZdFfyS1KGGbPOQ%3D%3D

## Nets that join several sheets
GND: Top Level (8 pins), Voltage Regulator (C1.2 C2.2 IC1.2 IC1.4), Pneumatics (8 pins), Gyroscope (11 pins), RS485 (12 pins), Encoders (24 pins)
3V3: Top Level (U1.3V3-1), Gyroscope (8 pins)
5V: Top Level (U1.VIN), Voltage Regulator (C2.1 IC1.3), RS485 (9 pins), Encoders (P1.4 P2.4 P3.4)
ALeft: Top Level (U1.8-TX2/IN1), Encoders (RN1.7 RN2.6)
AMiddle: Top Level (U1.5-IN2), Encoders (RN3.7 RN4.6)
ARight: Top Level (U1.2-OUT2), Encoders (RN5.7 RN6.6)
BLeft: Top Level (U1.9-OUT1C), Encoders (RN1.8 RN2.8)
BMiddle: Top Level (U1.6-OUT1D), Encoders (RN3.8 RN4.8)
BRight: Top Level (U1.3-LRCLK2), Encoders (RN5.8 RN6.8)
RA: Top Level (J1.1), RS485 (R12.2 U3.6)
RB: Top Level (J1.2), RS485 (R12.1 U3.7)
RX: Top Level (U1.0-RX1/CS1/CRX2), RS485 (IC6.3 U3.1)
S1C: Top Level (U1.30-CRX3), Pneumatics (IC2.2)
S1G: Top Level (J3.2), Pneumatics (IC2.6)
S2C: Top Level (U1.29-TX7), Pneumatics (IC2.5)
S2G: Top Level (J3.4), Pneumatics (IC2.3)
S3C: Top Level (U1.32-OUT1B), Pneumatics (IC3.2)
S3G: Top Level (J3.6), Pneumatics (IC3.6)
S4C: Top Level (U1.31-CTX3), Pneumatics (IC3.5)
S4G: Top Level (J3.8), Pneumatics (IC3.3)
S5C: Top Level (U1.26-A12/MOSI1), Pneumatics (IC4.2)
S5G: Top Level (J4.2), Pneumatics (IC4.6)
S6C: Top Level (U1.25-A11/RX6/SDA2), Pneumatics (IC4.5)
S6G: Top Level (J4.4), Pneumatics (IC4.3)
S7C: Top Level (U1.28-RX7), Pneumatics (IC5.2)
S7G: Top Level (J4.6), Pneumatics (IC5.6)
S8C: Top Level (U1.27-A13/SCK1), Pneumatics (IC5.5)
S8G: Top Level (J4.8), Pneumatics (IC5.3)
SCL: Top Level (U1.16-A2/RX4/SCL1), Gyroscope (R1.1 U2.19)
SDA: Top Level (U1.17-A3/TX4/SDA1), Gyroscope (R2.1 U2.20)
TA: Top Level (J2.1), RS485 (R13.2 U4.6)
TB: Top Level (J2.2), RS485 (R13.1 U4.7)
TX: Top Level (U1.1-TX1/MISO1/CTX2), RS485 (IC6.5 U4.4)
VBat: Top Level (9 pins), Voltage Regulator (C1.1 IC1.1)
XLeft: Top Level (U1.10-CS\MQSR), Encoders (RN1.6 RN2.4)
XMiddle: Top Level (U1.7-RX2/OUT1A), Encoders (RN3.6 RN4.4)
XRight: Top Level (U1.4-BCLK2), Encoders (RN5.6 RN6.4)